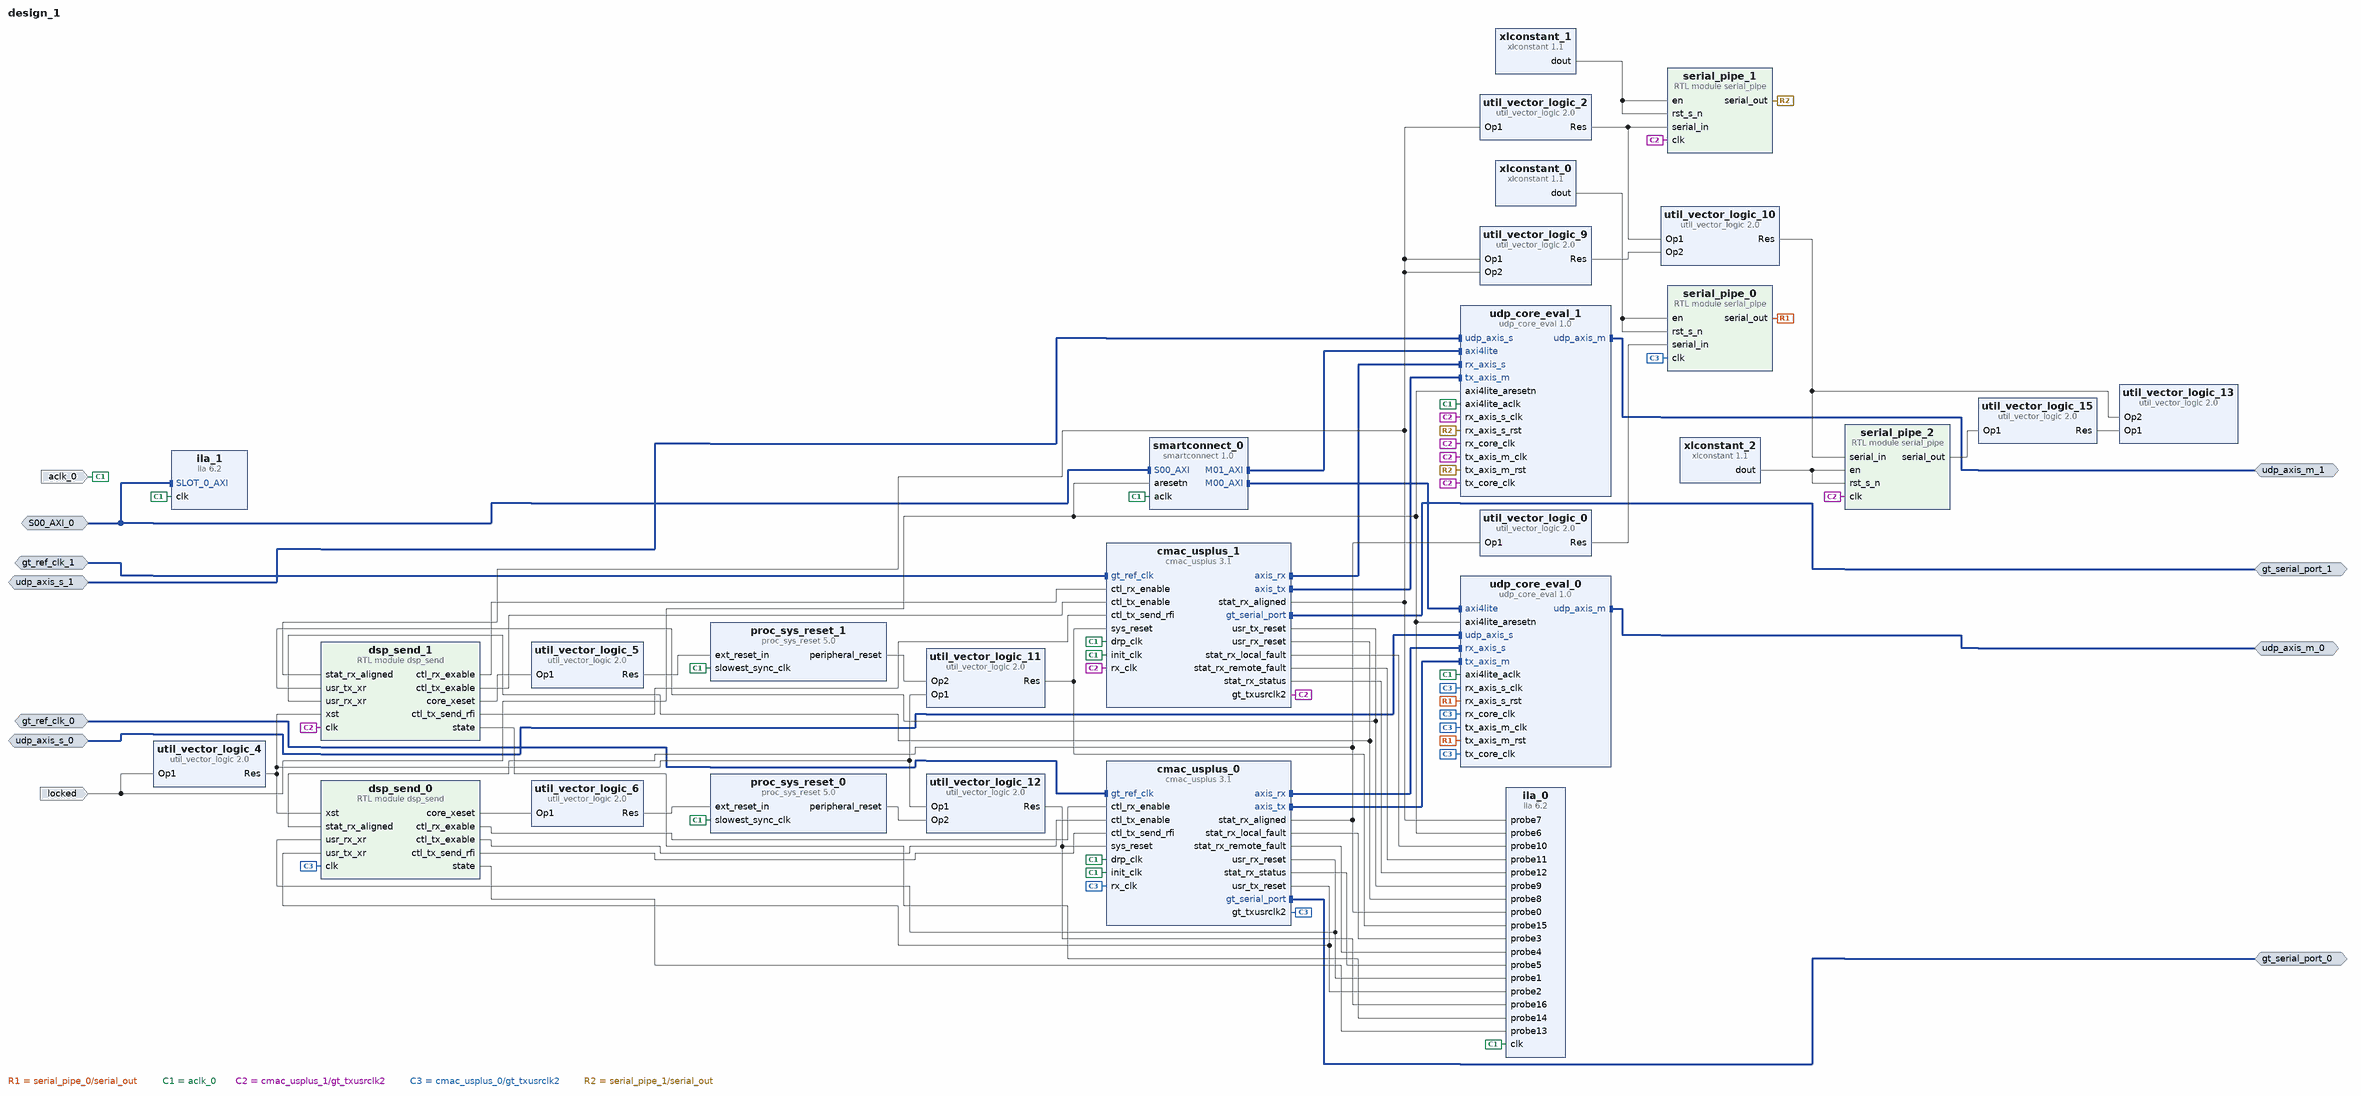
[diagram p0: block diagram of the top level]
# Vivado block design design_1, xcu280-fsvh2892-2L-e, Vivado 2020.2
create_bd_design design_1

create_bd_intf_port -mode Slave -vlnv xilinx.com:interface:aximm_rtl:1.0 S00_AXI_0
set_property -dict [list \
  CONFIG.ADDR_WIDTH 32 \
  CONFIG.ARUSER_WIDTH 0 \
  CONFIG.AWUSER_WIDTH 0 \
  CONFIG.BUSER_WIDTH 0 \
  CONFIG.DATA_WIDTH 32 \
  CONFIG.HAS_BRESP 1 \
  CONFIG.HAS_BURST 1 \
  CONFIG.HAS_CACHE 1 \
  CONFIG.HAS_LOCK 1 \
  CONFIG.HAS_PROT 1 \
  CONFIG.HAS_QOS 1 \
  CONFIG.HAS_REGION 0 \
  CONFIG.HAS_RRESP 1 \
  CONFIG.HAS_WSTRB 1 \
  CONFIG.ID_WIDTH 0 \
  CONFIG.MAX_BURST_LENGTH 1 \
  CONFIG.NUM_READ_OUTSTANDING 2 \
  CONFIG.NUM_READ_THREADS 1 \
  CONFIG.NUM_WRITE_OUTSTANDING 2 \
  CONFIG.NUM_WRITE_THREADS 1 \
  CONFIG.PROTOCOL AXI4LITE \
  CONFIG.READ_WRITE_MODE READ_WRITE \
  CONFIG.RUSER_BITS_PER_BYTE 0 \
  CONFIG.RUSER_WIDTH 0 \
  CONFIG.SUPPORTS_NARROW_BURST 0 \
  CONFIG.WUSER_BITS_PER_BYTE 0 \
  CONFIG.WUSER_WIDTH 0 \
] [get_bd_intf_ports S00_AXI_0]
create_bd_intf_port -mode Slave -vlnv xilinx.com:interface:diff_clock_rtl:1.0 gt_ref_clk_0
set_property -dict {CONFIG.FREQ_HZ 156250000} [get_bd_intf_ports gt_ref_clk_0]
create_bd_intf_port -mode Slave -vlnv xilinx.com:interface:diff_clock_rtl:1.0 gt_ref_clk_1
set_property -dict {CONFIG.FREQ_HZ 156250000} [get_bd_intf_ports gt_ref_clk_1]
create_bd_intf_port -mode Master -vlnv xilinx.com:interface:gt_rtl:1.0 gt_serial_port_0
create_bd_intf_port -mode Master -vlnv xilinx.com:interface:gt_rtl:1.0 gt_serial_port_1
create_bd_intf_port -mode Master -vlnv xilinx.com:interface:axis_rtl:1.0 udp_axis_m_0
set_property -dict {CONFIG.FREQ_HZ 322265625} [get_bd_intf_ports udp_axis_m_0]
create_bd_intf_port -mode Master -vlnv xilinx.com:interface:axis_rtl:1.0 udp_axis_m_1
set_property -dict {CONFIG.FREQ_HZ 322265625} [get_bd_intf_ports udp_axis_m_1]
create_bd_intf_port -mode Slave -vlnv xilinx.com:interface:axis_rtl:1.0 udp_axis_s_0
set_property -dict [list \
  CONFIG.FREQ_HZ 322265625 \
  CONFIG.HAS_TKEEP 1 \
  CONFIG.HAS_TLAST 1 \
  CONFIG.HAS_TREADY 1 \
  CONFIG.HAS_TSTRB 0 \
  CONFIG.LAYERED_METADATA undef \
  CONFIG.TDATA_NUM_BYTES 64 \
  CONFIG.TDEST_WIDTH 0 \
  CONFIG.TID_WIDTH 8 \
  CONFIG.TUSER_WIDTH 32 \
] [get_bd_intf_ports udp_axis_s_0]
create_bd_intf_port -mode Slave -vlnv xilinx.com:interface:axis_rtl:1.0 udp_axis_s_1
set_property -dict [list \
  CONFIG.FREQ_HZ 322265625 \
  CONFIG.HAS_TKEEP 1 \
  CONFIG.HAS_TLAST 1 \
  CONFIG.HAS_TREADY 1 \
  CONFIG.HAS_TSTRB 0 \
  CONFIG.LAYERED_METADATA undef \
  CONFIG.TDATA_NUM_BYTES 64 \
  CONFIG.TDEST_WIDTH 0 \
  CONFIG.TID_WIDTH 8 \
  CONFIG.TUSER_WIDTH 32 \
] [get_bd_intf_ports udp_axis_s_1]
create_bd_port -dir I -type clk aclk_0
set_property -dict {CONFIG.ASSOCIATED_BUSIF S00_AXI_0} [get_bd_ports aclk_0]
create_bd_port -dir I locked

create_bd_cell -type ip -vlnv xilinx.com:ip:cmac_usplus:3.1 cmac_usplus_0
set_property -dict [list \
  CONFIG.CMAC_CAUI4_MODE 1 \
  CONFIG.CMAC_CORE_SELECT CMACE4_X0Y5 \
  CONFIG.GT_GROUP_SELECT {X0Y40~X0Y43} \
  CONFIG.GT_REF_CLK_FREQ 156.25 \
  CONFIG.NUM_LANES 4x25 \
  CONFIG.PLL_TYPE QPLL0 \
  CONFIG.RX_FLOW_CONTROL 0 \
  CONFIG.RX_GT_BUFFER 1 \
  CONFIG.TX_FLOW_CONTROL 0 \
  CONFIG.USER_INTERFACE AXIS \
] [get_bd_cells cmac_usplus_0]
create_bd_cell -type ip -vlnv xilinx.com:ip:cmac_usplus:3.1 cmac_usplus_1
set_property -dict [list \
  CONFIG.CMAC_CAUI4_MODE 1 \
  CONFIG.CMAC_CORE_SELECT CMACE4_X0Y7 \
  CONFIG.GT_GROUP_SELECT {X0Y44~X0Y47} \
  CONFIG.GT_REF_CLK_FREQ 156.25 \
  CONFIG.NUM_LANES 4x25 \
  CONFIG.PLL_TYPE QPLL1 \
  CONFIG.RX_FLOW_CONTROL 0 \
  CONFIG.RX_GT_BUFFER 1 \
  CONFIG.TX_FLOW_CONTROL 0 \
  CONFIG.USER_INTERFACE AXIS \
] [get_bd_cells cmac_usplus_1]
create_bd_cell -type module -reference dsp_send dsp_send_0
create_bd_cell -type module -reference dsp_send dsp_send_1
create_bd_cell -type ip -vlnv xilinx.com:ip:ila:6.2 ila_0
set_property -dict [list \
  CONFIG.ALL_PROBE_SAME_MU_CNT 1 \
  CONFIG.C_ADV_TRIGGER false \
  CONFIG.C_ENABLE_ILA_AXI_MON false \
  CONFIG.C_EN_STRG_QUAL 0 \
  CONFIG.C_INPUT_PIPE_STAGES 3 \
  CONFIG.C_MONITOR_TYPE Native \
  CONFIG.C_NUM_OF_PROBES 17 \
  CONFIG.C_PROBE0_MU_CNT 1 \
  CONFIG.C_PROBE10_MU_CNT 1 \
  CONFIG.C_PROBE11_MU_CNT 1 \
  CONFIG.C_PROBE12_MU_CNT 1 \
  CONFIG.C_PROBE13_MU_CNT 1 \
  CONFIG.C_PROBE13_WIDTH 4 \
  CONFIG.C_PROBE14_MU_CNT 1 \
  CONFIG.C_PROBE14_WIDTH 4 \
  CONFIG.C_PROBE1_MU_CNT 1 \
  CONFIG.C_PROBE2_MU_CNT 1 \
  CONFIG.C_PROBE3_MU_CNT 1 \
  CONFIG.C_PROBE4_MU_CNT 1 \
  CONFIG.C_PROBE5_MU_CNT 1 \
  CONFIG.C_PROBE6_MU_CNT 1 \
  CONFIG.C_PROBE7_MU_CNT 1 \
  CONFIG.C_PROBE8_MU_CNT 1 \
  CONFIG.C_PROBE9_MU_CNT 1 \
] [get_bd_cells ila_0]
create_bd_cell -type ip -vlnv xilinx.com:ip:ila:6.2 ila_1
set_property -dict [list \
  CONFIG.ALL_PROBE_SAME_MU_CNT 1 \
  CONFIG.C_ADV_TRIGGER false \
  CONFIG.C_ENABLE_ILA_AXI_MON true \
  CONFIG.C_EN_STRG_QUAL 0 \
  CONFIG.C_INPUT_PIPE_STAGES 3 \
  CONFIG.C_MONITOR_TYPE AXI \
  CONFIG.C_NUM_OF_PROBES 19 \
  CONFIG.C_PROBE0_MU_CNT 1 \
  CONFIG.C_PROBE10_MU_CNT 1 \
  CONFIG.C_PROBE11_MU_CNT 1 \
  CONFIG.C_PROBE12_MU_CNT 1 \
  CONFIG.C_PROBE13_MU_CNT 1 \
  CONFIG.C_PROBE13_WIDTH 1 \
  CONFIG.C_PROBE14_MU_CNT 1 \
  CONFIG.C_PROBE14_WIDTH 1 \
  CONFIG.C_PROBE15_MU_CNT 1 \
  CONFIG.C_PROBE16_MU_CNT 1 \
  CONFIG.C_PROBE17_MU_CNT 1 \
  CONFIG.C_PROBE18_MU_CNT 1 \
  CONFIG.C_PROBE19_MU_CNT 1 \
  CONFIG.C_PROBE1_MU_CNT 1 \
  CONFIG.C_PROBE20_MU_CNT 1 \
  CONFIG.C_PROBE21_MU_CNT 1 \
  CONFIG.C_PROBE22_MU_CNT 1 \
  CONFIG.C_PROBE23_MU_CNT 1 \
  CONFIG.C_PROBE24_MU_CNT 1 \
  CONFIG.C_PROBE25_MU_CNT 1 \
  CONFIG.C_PROBE26_MU_CNT 1 \
  CONFIG.C_PROBE27_MU_CNT 1 \
  CONFIG.C_PROBE28_MU_CNT 1 \
  CONFIG.C_PROBE29_MU_CNT 1 \
  CONFIG.C_PROBE2_MU_CNT 1 \
  CONFIG.C_PROBE30_MU_CNT 1 \
  CONFIG.C_PROBE31_MU_CNT 1 \
  CONFIG.C_PROBE32_MU_CNT 1 \
  CONFIG.C_PROBE33_MU_CNT 1 \
  CONFIG.C_PROBE34_MU_CNT 1 \
  CONFIG.C_PROBE35_MU_CNT 1 \
  CONFIG.C_PROBE36_MU_CNT 1 \
  CONFIG.C_PROBE37_MU_CNT 1 \
  CONFIG.C_PROBE38_MU_CNT 1 \
  CONFIG.C_PROBE39_MU_CNT 1 \
  CONFIG.C_PROBE3_MU_CNT 1 \
  CONFIG.C_PROBE40_MU_CNT 1 \
  CONFIG.C_PROBE41_MU_CNT 1 \
  CONFIG.C_PROBE42_MU_CNT 1 \
  CONFIG.C_PROBE43_MU_CNT 1 \
  CONFIG.C_PROBE4_MU_CNT 1 \
  CONFIG.C_PROBE5_MU_CNT 1 \
  CONFIG.C_PROBE6_MU_CNT 1 \
  CONFIG.C_PROBE7_MU_CNT 1 \
  CONFIG.C_PROBE8_MU_CNT 1 \
  CONFIG.C_PROBE9_MU_CNT 1 \
] [get_bd_cells ila_1]
create_bd_cell -type ip -vlnv xilinx.com:ip:proc_sys_reset:5.0 proc_sys_reset_0
create_bd_cell -type ip -vlnv xilinx.com:ip:proc_sys_reset:5.0 proc_sys_reset_1
create_bd_cell -type module -reference serial_pipe serial_pipe_0
create_bd_cell -type module -reference serial_pipe serial_pipe_1
create_bd_cell -type module -reference serial_pipe serial_pipe_2
create_bd_cell -type ip -vlnv xilinx.com:ip:smartconnect:1.0 smartconnect_0
set_property -dict {CONFIG.NUM_MI 2 CONFIG.NUM_SI 1} [get_bd_cells smartconnect_0]
create_bd_cell -type ip -vlnv stfc_tech:user:udp_core_eval:1.0 udp_core_eval_0
create_bd_cell -type ip -vlnv stfc_tech:user:udp_core_eval:1.0 udp_core_eval_1
create_bd_cell -type ip -vlnv xilinx.com:ip:util_vector_logic:2.0 util_vector_logic_0
set_property -dict {CONFIG.C_OPERATION not CONFIG.C_SIZE 1} [get_bd_cells util_vector_logic_0]
create_bd_cell -type ip -vlnv xilinx.com:ip:util_vector_logic:2.0 util_vector_logic_2
set_property -dict {CONFIG.C_OPERATION not CONFIG.C_SIZE 1} [get_bd_cells util_vector_logic_2]
create_bd_cell -type ip -vlnv xilinx.com:ip:util_vector_logic:2.0 util_vector_logic_4
set_property -dict {CONFIG.C_OPERATION not CONFIG.C_SIZE 1} [get_bd_cells util_vector_logic_4]
create_bd_cell -type ip -vlnv xilinx.com:ip:util_vector_logic:2.0 util_vector_logic_5
set_property -dict {CONFIG.C_OPERATION not CONFIG.C_SIZE 1} [get_bd_cells util_vector_logic_5]
create_bd_cell -type ip -vlnv xilinx.com:ip:util_vector_logic:2.0 util_vector_logic_6
set_property -dict {CONFIG.C_OPERATION not CONFIG.C_SIZE 1} [get_bd_cells util_vector_logic_6]
create_bd_cell -type ip -vlnv xilinx.com:ip:util_vector_logic:2.0 util_vector_logic_9
set_property -dict {CONFIG.C_OPERATION or CONFIG.C_SIZE 1} [get_bd_cells util_vector_logic_9]
create_bd_cell -type ip -vlnv xilinx.com:ip:util_vector_logic:2.0 util_vector_logic_10
set_property -dict {CONFIG.C_OPERATION and CONFIG.C_SIZE 1} [get_bd_cells util_vector_logic_10]
create_bd_cell -type ip -vlnv xilinx.com:ip:util_vector_logic:2.0 util_vector_logic_11
set_property -dict {CONFIG.C_OPERATION or CONFIG.C_SIZE 1} [get_bd_cells util_vector_logic_11]
create_bd_cell -type ip -vlnv xilinx.com:ip:util_vector_logic:2.0 util_vector_logic_12
set_property -dict {CONFIG.C_OPERATION or CONFIG.C_SIZE 1} [get_bd_cells util_vector_logic_12]
create_bd_cell -type ip -vlnv xilinx.com:ip:util_vector_logic:2.0 util_vector_logic_13
set_property -dict {CONFIG.C_OPERATION and CONFIG.C_SIZE 1} [get_bd_cells util_vector_logic_13]
create_bd_cell -type ip -vlnv xilinx.com:ip:util_vector_logic:2.0 util_vector_logic_15
set_property -dict {CONFIG.C_OPERATION not CONFIG.C_SIZE 1} [get_bd_cells util_vector_logic_15]
create_bd_cell -type ip -vlnv xilinx.com:ip:xlconstant:1.1 xlconstant_0
create_bd_cell -type ip -vlnv xilinx.com:ip:xlconstant:1.1 xlconstant_1
create_bd_cell -type ip -vlnv xilinx.com:ip:xlconstant:1.1 xlconstant_2

# ---- connections ----

connect_bd_intf_net -intf_net cmac_usplus_0_gt_serial_port [get_bd_intf_ports gt_serial_port_1] [get_bd_intf_pins cmac_usplus_1/gt_serial_port]
connect_bd_intf_net -intf_net cmac_usplus_0_axis_rx [get_bd_intf_pins cmac_usplus_1/axis_rx] [get_bd_intf_pins udp_core_eval_1/rx_axis_s]
connect_bd_intf_net [get_bd_intf_pins cmac_usplus_1/axis_tx] [get_bd_intf_pins udp_core_eval_1/tx_axis_m]
connect_bd_intf_net -intf_net S00_AXI_0_1 [get_bd_intf_ports S00_AXI_0] [get_bd_intf_pins smartconnect_0/S00_AXI]
connect_bd_intf_net [get_bd_intf_ports S00_AXI_0] [get_bd_intf_pins ila_1/SLOT_0_AXI]
connect_bd_intf_net -intf_net cmac_usplus_1_axis_rx [get_bd_intf_pins cmac_usplus_0/axis_rx] [get_bd_intf_pins udp_core_eval_0/rx_axis_s]
connect_bd_intf_net -intf_net cmac_usplus_1_gt_serial_port [get_bd_intf_ports gt_serial_port_0] [get_bd_intf_pins cmac_usplus_0/gt_serial_port]
connect_bd_intf_net -intf_net gt_ref_clk_0_1 [get_bd_intf_ports gt_ref_clk_0] [get_bd_intf_pins cmac_usplus_0/gt_ref_clk]
connect_bd_intf_net -intf_net gt_ref_clk_1_1 [get_bd_intf_ports gt_ref_clk_1] [get_bd_intf_pins cmac_usplus_1/gt_ref_clk]
connect_bd_intf_net [get_bd_intf_pins smartconnect_0/M00_AXI] [get_bd_intf_pins udp_core_eval_0/axi4lite]
connect_bd_intf_net [get_bd_intf_pins smartconnect_0/M01_AXI] [get_bd_intf_pins udp_core_eval_1/axi4lite]
connect_bd_intf_net [get_bd_intf_pins cmac_usplus_0/axis_tx] [get_bd_intf_pins udp_core_eval_0/tx_axis_m]
connect_bd_intf_net -intf_net udp_axis_s_0_1 [get_bd_intf_ports udp_axis_s_0] [get_bd_intf_pins udp_core_eval_0/udp_axis_s]
connect_bd_intf_net -intf_net udp_axis_s_1_1 [get_bd_intf_ports udp_axis_s_1] [get_bd_intf_pins udp_core_eval_1/udp_axis_s]
connect_bd_intf_net [get_bd_intf_ports udp_axis_m_0] [get_bd_intf_pins udp_core_eval_0/udp_axis_m]
connect_bd_intf_net [get_bd_intf_ports udp_axis_m_1] [get_bd_intf_pins udp_core_eval_1/udp_axis_m]
connect_bd_net [get_bd_pins cmac_usplus_0/stat_rx_aligned] \
  [get_bd_pins dsp_send_0/stat_rx_aligned] [get_bd_pins ila_0/probe0] [get_bd_pins util_vector_logic_0/Op1]
connect_bd_net [get_bd_pins serial_pipe_0/serial_out] [get_bd_pins udp_core_eval_0/rx_axis_s_rst] [get_bd_pins udp_core_eval_0/tx_axis_m_rst]
connect_bd_net [get_bd_pins xlconstant_0/dout] [get_bd_pins serial_pipe_0/en] [get_bd_pins serial_pipe_0/rst_s_n]
connect_bd_net -net axi4lite_aclk_0_1 [get_bd_ports aclk_0] \
  [get_bd_pins cmac_usplus_0/drp_clk] [get_bd_pins cmac_usplus_0/init_clk] [get_bd_pins cmac_usplus_1/drp_clk] \
  [get_bd_pins cmac_usplus_1/init_clk] [get_bd_pins ila_0/clk] [get_bd_pins ila_1/clk] \
  [get_bd_pins proc_sys_reset_0/slowest_sync_clk] [get_bd_pins proc_sys_reset_1/slowest_sync_clk] \
  [get_bd_pins smartconnect_0/aclk] [get_bd_pins udp_core_eval_0/axi4lite_aclk] [get_bd_pins udp_core_eval_1/axi4lite_aclk]
connect_bd_net -net axi4lite_aresetn_0_1 [get_bd_ports locked] \
  [get_bd_pins ila_0/probe6] [get_bd_pins smartconnect_0/aresetn] [get_bd_pins udp_core_eval_0/axi4lite_aresetn] \
  [get_bd_pins udp_core_eval_1/axi4lite_aresetn] [get_bd_pins util_vector_logic_4/Op1]
connect_bd_net -net cmac_usplus_0_stat_rx_local_fault [get_bd_pins cmac_usplus_1/stat_rx_local_fault] [get_bd_pins ila_0/probe10]
connect_bd_net -net cmac_usplus_0_stat_rx_remote_fault [get_bd_pins cmac_usplus_1/stat_rx_remote_fault] [get_bd_pins ila_0/probe11]
connect_bd_net -net cmac_usplus_0_stat_rx_status [get_bd_pins cmac_usplus_1/stat_rx_status] [get_bd_pins ila_0/probe12]
connect_bd_net -net cmac_usplus_0_usr_tx_reset [get_bd_pins cmac_usplus_1/usr_tx_reset] [get_bd_pins dsp_send_1/usr_tx_xr] [get_bd_pins ila_0/probe9]
connect_bd_net [get_bd_pins cmac_usplus_1/gt_txusrclk2] \
  [get_bd_pins cmac_usplus_1/rx_clk] [get_bd_pins dsp_send_1/clk] [get_bd_pins serial_pipe_1/clk] \
  [get_bd_pins serial_pipe_2/clk] [get_bd_pins udp_core_eval_1/rx_axis_s_clk] [get_bd_pins udp_core_eval_1/rx_core_clk] \
  [get_bd_pins udp_core_eval_1/tx_axis_m_clk] [get_bd_pins udp_core_eval_1/tx_core_clk]
connect_bd_net [get_bd_pins cmac_usplus_1/stat_rx_aligned] \
  [get_bd_pins dsp_send_1/stat_rx_aligned] [get_bd_pins ila_0/probe7] [get_bd_pins util_vector_logic_2/Op1] \
  [get_bd_pins util_vector_logic_9/Op1] [get_bd_pins util_vector_logic_9/Op2]
connect_bd_net -net cmac_usplus_1_stat_rx_local_fault [get_bd_pins cmac_usplus_0/stat_rx_local_fault] [get_bd_pins ila_0/probe3]
connect_bd_net -net cmac_usplus_1_stat_rx_remote_fault [get_bd_pins cmac_usplus_0/stat_rx_remote_fault] [get_bd_pins ila_0/probe4]
connect_bd_net -net cmac_usplus_1_stat_rx_status [get_bd_pins cmac_usplus_0/stat_rx_status] [get_bd_pins ila_0/probe5]
connect_bd_net [get_bd_pins cmac_usplus_1/usr_rx_reset] [get_bd_pins dsp_send_1/usr_rx_xr] [get_bd_pins ila_0/probe8]
connect_bd_net -net cmac_usplus_1_usr_rx_reset1 [get_bd_pins cmac_usplus_0/usr_rx_reset] [get_bd_pins dsp_send_0/usr_rx_xr] [get_bd_pins ila_0/probe1]
connect_bd_net -net cmac_usplus_1_usr_tx_reset [get_bd_pins cmac_usplus_0/usr_tx_reset] [get_bd_pins dsp_send_0/usr_tx_xr] [get_bd_pins ila_0/probe2]
connect_bd_net -net cmac_usplus_2_gt_txusrclk2 [get_bd_pins cmac_usplus_0/gt_txusrclk2] \
  [get_bd_pins cmac_usplus_0/rx_clk] [get_bd_pins dsp_send_0/clk] [get_bd_pins serial_pipe_0/clk] \
  [get_bd_pins udp_core_eval_0/rx_axis_s_clk] [get_bd_pins udp_core_eval_0/rx_core_clk] \
  [get_bd_pins udp_core_eval_0/tx_axis_m_clk] [get_bd_pins udp_core_eval_0/tx_core_clk]
connect_bd_net [get_bd_pins dsp_send_0/core_xeset] [get_bd_pins util_vector_logic_6/Op1]
connect_bd_net -net dsp_send_0_ctl_rx_enable [get_bd_pins dsp_send_1/ctl_rx_exable] [get_bd_pins cmac_usplus_1/ctl_rx_enable]
connect_bd_net -net dsp_send_0_ctl_tx_enable [get_bd_pins dsp_send_1/ctl_tx_exable] [get_bd_pins cmac_usplus_1/ctl_tx_enable]
connect_bd_net -net dsp_send_0_ctl_tx_send_rfi [get_bd_pins dsp_send_1/ctl_tx_send_rfi] [get_bd_pins cmac_usplus_1/ctl_tx_send_rfi]
connect_bd_net [get_bd_pins dsp_send_0/state] [get_bd_pins ila_0/probe13]
connect_bd_net [get_bd_pins dsp_send_1/core_xeset] [get_bd_pins util_vector_logic_5/Op1]
connect_bd_net [get_bd_pins dsp_send_1/state] [get_bd_pins ila_0/probe14]
connect_bd_net -net dsp_send_2_ctl_rx_exable [get_bd_pins dsp_send_0/ctl_rx_exable] [get_bd_pins cmac_usplus_0/ctl_rx_enable]
connect_bd_net -net dsp_send_2_ctl_tx_exable [get_bd_pins dsp_send_0/ctl_tx_exable] [get_bd_pins cmac_usplus_0/ctl_tx_enable]
connect_bd_net -net dsp_send_2_ctl_tx_send_rfi [get_bd_pins dsp_send_0/ctl_tx_send_rfi] [get_bd_pins cmac_usplus_0/ctl_tx_send_rfi]
connect_bd_net [get_bd_pins proc_sys_reset_0/peripheral_reset] [get_bd_pins util_vector_logic_12/Op2]
connect_bd_net [get_bd_pins proc_sys_reset_1/peripheral_reset] [get_bd_pins util_vector_logic_11/Op2]
connect_bd_net [get_bd_pins serial_pipe_1/serial_out] [get_bd_pins udp_core_eval_1/rx_axis_s_rst] [get_bd_pins udp_core_eval_1/tx_axis_m_rst]
connect_bd_net [get_bd_pins serial_pipe_2/serial_out] [get_bd_pins util_vector_logic_15/Op1]
connect_bd_net [get_bd_pins util_vector_logic_0/Res] [get_bd_pins serial_pipe_0/serial_in]
connect_bd_net [get_bd_pins util_vector_logic_10/Res] [get_bd_pins serial_pipe_2/serial_in] [get_bd_pins util_vector_logic_13/Op2]
connect_bd_net [get_bd_pins util_vector_logic_11/Res] [get_bd_pins cmac_usplus_1/sys_reset] [get_bd_pins ila_0/probe15]
connect_bd_net [get_bd_pins util_vector_logic_12/Res] [get_bd_pins cmac_usplus_0/sys_reset] [get_bd_pins ila_0/probe16]
connect_bd_net [get_bd_pins util_vector_logic_15/Res] [get_bd_pins util_vector_logic_13/Op1]
connect_bd_net [get_bd_pins util_vector_logic_2/Res] [get_bd_pins serial_pipe_1/serial_in] [get_bd_pins util_vector_logic_10/Op1]
connect_bd_net [get_bd_pins util_vector_logic_4/Res] \
  [get_bd_pins dsp_send_0/xst] [get_bd_pins dsp_send_1/xst] [get_bd_pins util_vector_logic_11/Op1] \
  [get_bd_pins util_vector_logic_12/Op1]
connect_bd_net [get_bd_pins util_vector_logic_5/Res] [get_bd_pins proc_sys_reset_1/ext_reset_in]
connect_bd_net [get_bd_pins util_vector_logic_6/Res] [get_bd_pins proc_sys_reset_0/ext_reset_in]
connect_bd_net [get_bd_pins util_vector_logic_9/Res] [get_bd_pins util_vector_logic_10/Op2]
connect_bd_net [get_bd_pins xlconstant_1/dout] [get_bd_pins serial_pipe_1/en] [get_bd_pins serial_pipe_1/rst_s_n]
connect_bd_net [get_bd_pins xlconstant_2/dout] [get_bd_pins serial_pipe_2/en] [get_bd_pins serial_pipe_2/rst_s_n]

# ---- address map ----
assign_bd_address -offset 0x00000000 -range 8K -target_address_space [get_bd_addr_spaces S00_AXI_0] [get_bd_addr_segs udp_core_eval_0/axi4lite/reg0]
assign_bd_address -offset 0x00002000 -range 8K -target_address_space [get_bd_addr_spaces S00_AXI_0] [get_bd_addr_segs udp_core_eval_1/axi4lite/reg0]

validate_bd_design
save_bd_design
